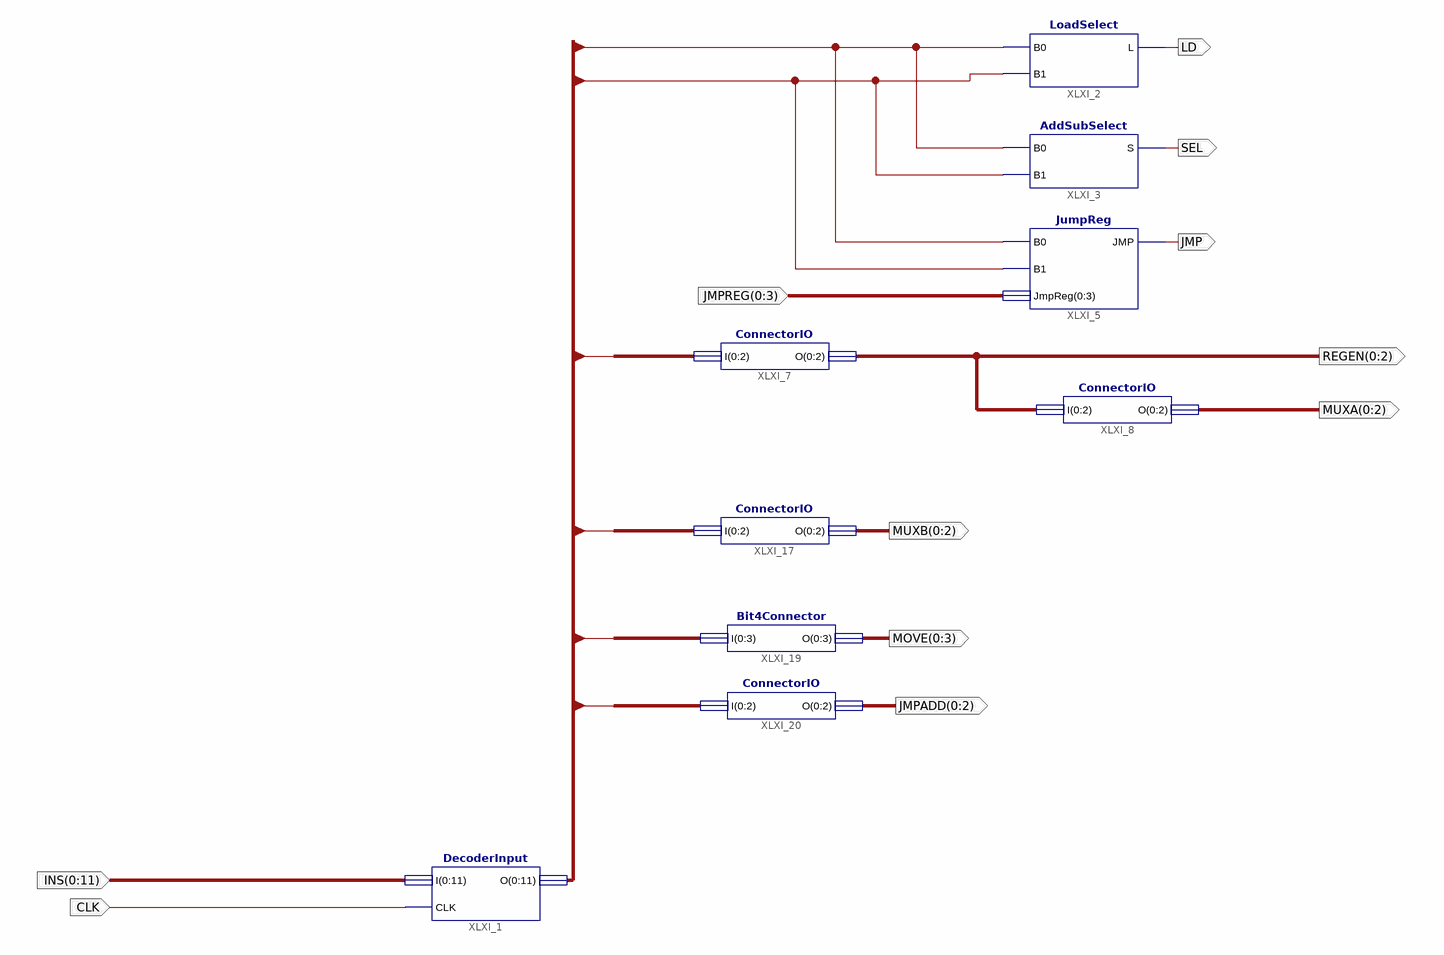
[diagram p0: schematic sheet 1]
// Xilinx ISE schematic InsDecoder.sch (spartan3e) as structural Verilog: 9 symbols, 11 ports
module InsDecoder (
  input  [0:11] INS,
  input  CLK,
  input  [0:3] JMPREG,
  output LD,
  output SEL,
  output JMP,
  output [0:2] REGEN,
  output [0:2] MUXA,
  output [0:2] MUXB,
  output [0:3] MOVE,
  output [0:2] JMPADD
);

  wire [11:0] B;

  DecoderInput XLXI_1 (
    .CLK(CLK), .I(INS), .O({B[0], B[1], B[2], B[3], B[4], B[5], B[6], B[7], B[8], B[9], B[10], B[11]}));
  LoadSelect XLXI_2 (.B0(B[0]), .B1(B[1]), .L(LD));
  AddSubSelect XLXI_3 (.B0(B[0]), .B1(B[1]), .S(SEL));
  JumpReg XLXI_5 (.B0(B[0]), .B1(B[1]), .JmpReg(JMPREG), .JMP(JMP));
  ConnectorIO XLXI_8 (.I(REGEN), .O(MUXA));
  ConnectorIO XLXI_7 (.I({B[2], B[3], B[4]}), .O(REGEN));
  ConnectorIO XLXI_17 (.I({B[5], B[6], B[7]}), .O(MUXB));
  Bit4Connector XLXI_19 (.I({B[8], B[9], B[10], B[11]}), .O(MOVE));
  ConnectorIO XLXI_20 (.I({B[9], B[10], B[11]}), .O(JMPADD));
endmodule
